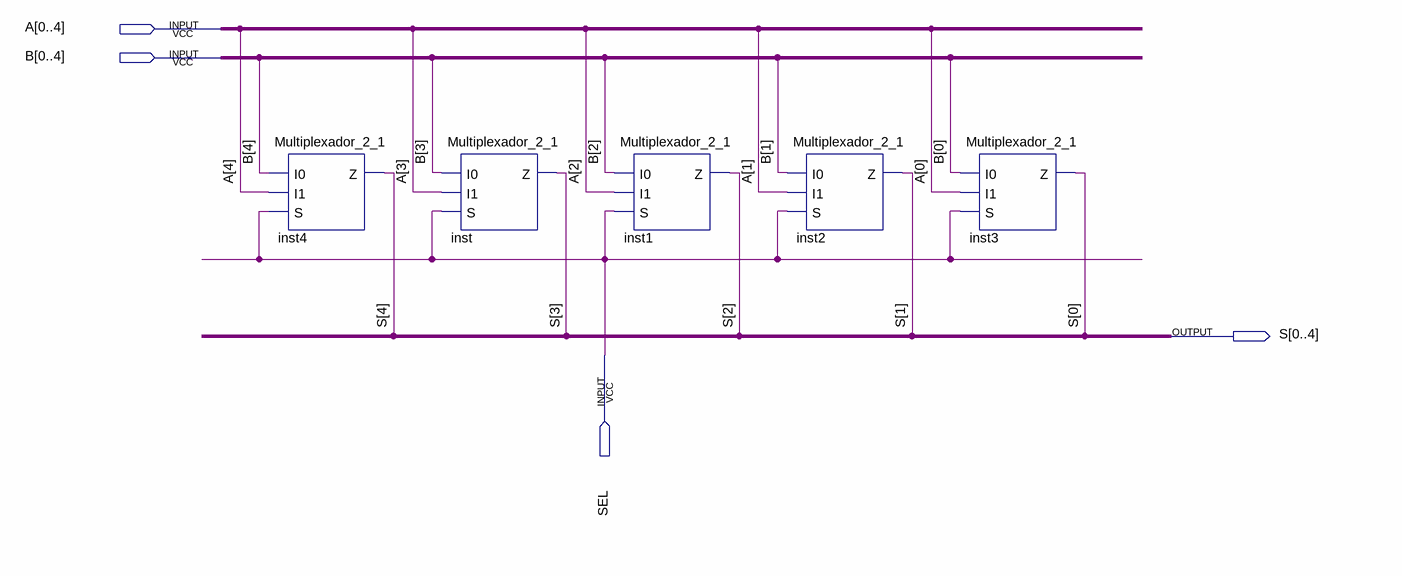
[diagram p0: schematic sheet]
// Quartus schematic Multiplexador_2_1_5bits.bdf as structural Verilog: 5 symbols, 4 pins
module Multiplexador_2_1_5bits (
  input  [0:4] A,
  input  [0:4] B,
  input  SEL,
  output [0:4] S
);

  Multiplexador_2_1 inst4 (.I0(B[4]), .I1(A[4]), .S(SEL), .Z(S[4]));
  Multiplexador_2_1 inst (.I0(B[3]), .I1(A[3]), .S(SEL), .Z(S[3]));
  Multiplexador_2_1 inst1 (.I0(B[2]), .I1(A[2]), .S(SEL), .Z(S[2]));
  Multiplexador_2_1 inst2 (.I0(B[1]), .I1(A[1]), .S(SEL), .Z(S[1]));
  Multiplexador_2_1 inst3 (.I0(B[0]), .I1(A[0]), .S(SEL), .Z(S[0]));
endmodule
